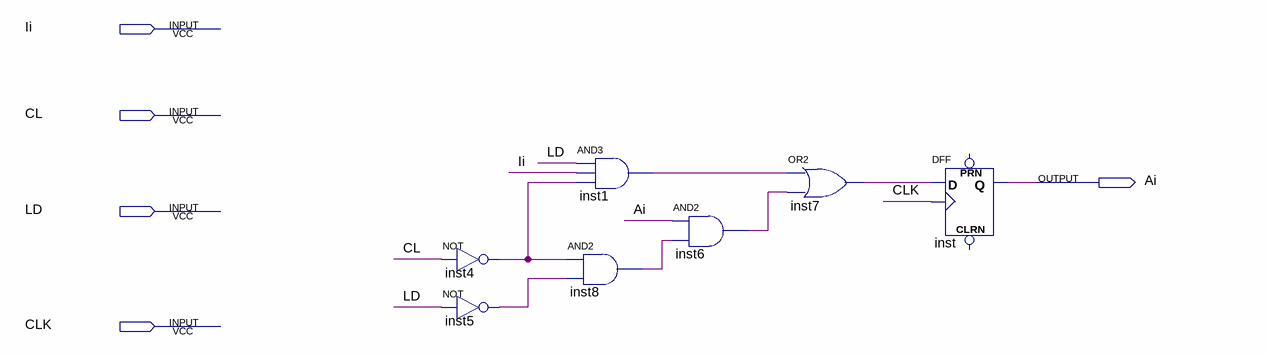
[diagram p0: schematic sheet]
// Quartus schematic REG1_LD_CL.bdf as structural Verilog: 7 symbols, 5 pins
module REG1_LD_CL (
  input  Ii,
  input  CL,
  input  LD,
  input  CLK,
  output Ai
);

  wire inst1_out, inst4_out, inst5_out, inst6_out, inst7_out, inst8_out;

  not inst4 (inst4_out, CL);
  not inst5 (inst5_out, LD);
  and inst1 (inst1_out, LD, Ii, inst4_out);
  and inst8 (inst8_out, inst4_out, inst5_out);
  and inst6 (inst6_out, Ai, inst8_out);
  or inst7 (inst7_out, inst1_out, inst6_out);
  DFF inst (.CLK(CLK), .D(inst7_out), .Q(Ai));  // open: CLRN, PRN
endmodule
